# EAGLE design TactA (EAGLE 6.6.0)
An electronic circuit that enables experiments with capacitive sensing. For more details visit: https://github.com/StudioNAND/tact-hardware.
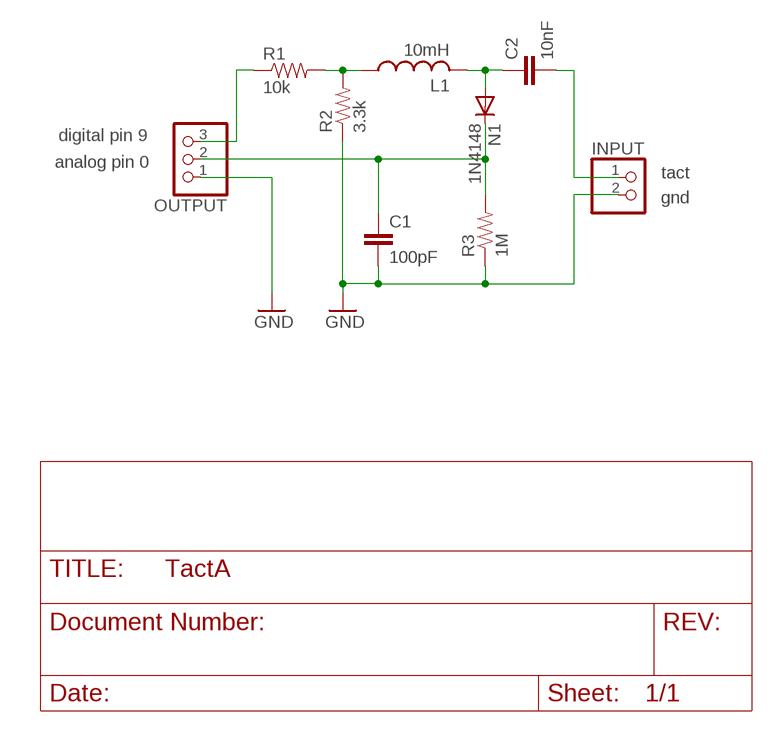
[diagram p0: schematic, sheet 1]

## Parts
C1  100pF  CAPPTH  [CAP-PTH-SMALL]
C2  10nF  CAPPTH  [CAP-PTH-SMALL]
INPUT  PINHD-1X2  [1X02]
L1  10mH  L-US6000-XXX-RC  [6000-XXXX-RC]
N1  1N4148  1N4148DO35-7  [DO35-7]
OUTPUT  PINHD-1X3  [1X03]
R1  10k  RESISTORPTH-1/4W  [AXIAL-0.4]
R2  3.3k  RESISTORPTH-1/4W  [AXIAL-0.4]
R3  1M  RESISTORPTH-1/4W  [AXIAL-0.4]

## Nets
A0: C1.1 N1.C OUTPUT.2 R3.P$2
D9: OUTPUT.3 R1.P$1
GND: C1.2 INPUT.2 OUTPUT.1 R2.P$1 R3.P$1
N$92: L1.1 R1.P$2 R2.P$2
N$144: C2.1 L1.2 N1.A
TACTSENSE: C2.2 INPUT.1

## Notes on the sheet
- digital pin 9
- analog pin 0
- tact
- gnd

## Library data of the parts
C1 C2 = SparkFun-Passives:CAP: Capacitor Standard 0603 ceramic capacitor, and 0.1" leaded capacitor.
INPUT = pinhead:PINHD-1X2: PIN HEADER
L1 = rcl:L-US: INDUCTOR, American symbol
N1 = diode:1N4148: DIODE high speed (Philips)
OUTPUT = pinhead:PINHD-1X3: PIN HEADER
R1-R3 = SparkFun-Passives:RESISTOR: Resistor Basic schematic elements and footprints for 0603, 1206, and PTH resistors.

## Board
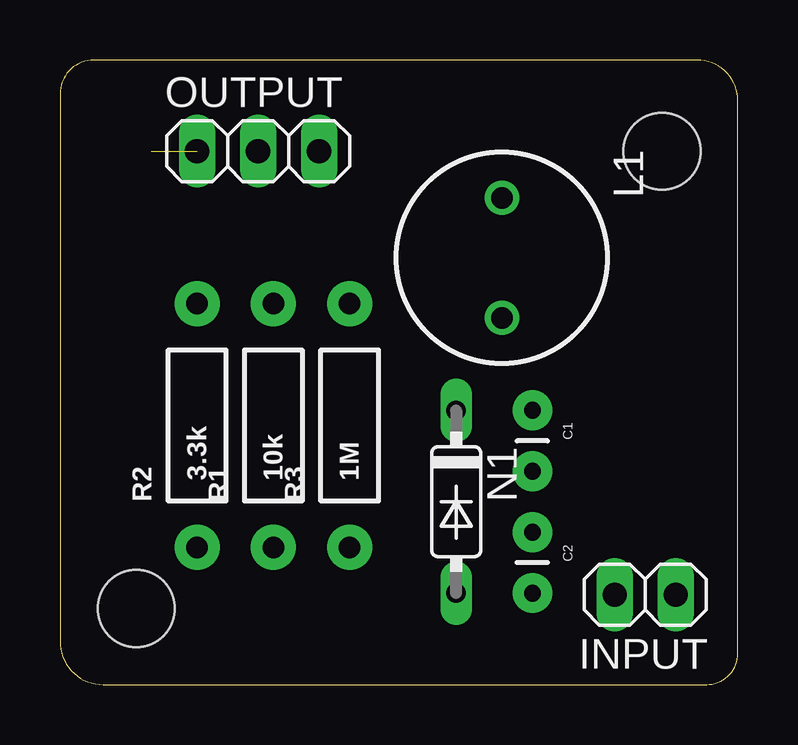
[diagram p1: board, top side]
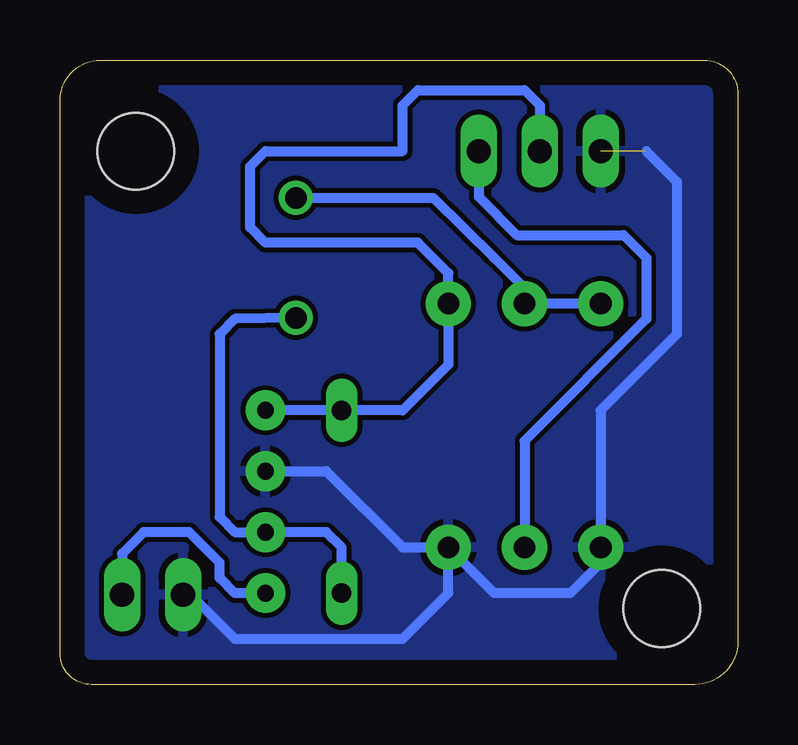
[diagram p2: board, bottom side, seen from below]

Size 28.25 x 26.02 mm. Coordinates in mm from the lower left corner, seen from the top.
Outline: 0,24.61 0,1.8 arc90 1.8,0 26.94,0 arc90 28.25,1.31 28.25,24.33 arc90 26.55,26.02 1.42,26.02 arc90 0,24.61
Copper layers (1*16): Top 0.035mm / dielectric 1.5mm / Bottom 0.035mm
Design rules "default *": minimum track width 10mil, minimum drill 24mil, track to track 8mil, track to pad 8mil, pad to pad 8mil, via to via 8mil, smd to smd 8mil, copper to edge 40mil, drill to drill 8mil, minimum pad ring 10mil, minimum via ring 8mil, stop-mask expansion 4mil, vias tented up to drill 0mil, thermal gap 10mil
Holes 3.2 mm at 3.17,3.17 25.08,22.23

### Footprints (pad centres in the part's own frame; a part is rotated, then mirrored left to right if it is on the bottom)
CAP-PTH-SMALL = drill 0.7 pad 1.651: 1 0,0; 2 2.54,0
1X02 = drill 1.016 long: 1 -1.27,0; 2 1.27,0
6000-XXXX-RC = drill 0.9 pad 1.422: 1 -2.5,0; 2 2.5,0
DO35-7 = drill 0.813 long: A 3.81,0; C -3.81,0
1X03 = drill 1.016 long: 1 -2.54,0; 2 0,0; 3 2.54,0
AXIAL-0.4 = drill 0.9 pad 1.88: P$1 -5.08,0; P$2 5.08,0

### Placement (x,y rotation side)
C1  19.68,11.43 270 top
C2  19.68,6.35 270 top
INPUT  24.38,3.75 180 top
L1  18.41,17.78 270 top
N1  16.51,7.62 270 top
OUTPUT  8.26,22.23 0 top
R1  8.89,10.79 90 top
R2  5.71,10.79 90 top
R3  12.06,10.79 90 top

### Tracks (layer width: path | path; a pad name or v marks a point on that pad's centre or on a via)
A0
  Bottom 0.406: C1.1 N1.C 13.97,11.43 12.06,13.34 R3.P$2 12.06,17.14 13.34,18.41 19.68,18.41 20.32,19.05 20.32,21.59 19.68,22.23 13.97,22.23 13.97,24.13 13.34,24.77 8.89,24.77 8.26,24.13 OUTPUT.2
D9
  Bottom 0.406: OUTPUT.3 10.79,20.32 9.21,18.73 4.76,18.73 3.81,17.78 3.81,15.24 8.89,10.16 R1.P$1
GND  (1 unrouted)
  Bottom 0.406: C1.2 17.14,8.89 13.97,5.71 R3.P$1 | R3.P$1 10.16,3.81 6.99,3.81 5.71,5.08 R2.P$1 5.71,11.43 2.54,14.61 2.54,20.95 3.81,22.23 | INPUT.2 22.8,3.75 20.95,1.91 13.97,1.91 12.06,3.81 R3.P$1
  pour Bottom: 0,0 0,25.4 27.94,25.4 27.94,0
N$92
  Bottom 0.406: L1.1 12.7,20.28 10.16,17.78 8.89,16.51 R1.P$2 R2.P$2
N$144
  Bottom 0.406: N1.A 16.51,5.71 17.14,6.35 C2.1 20.95,6.35 21.59,6.99 21.59,14.61 20.95,15.24 L1.2
TACTSENSE
  Bottom 0.406: C2.2 20.95,3.81 21.59,4.45 21.59,5.08 22.86,6.35 24.77,6.35 25.65,5.46 INPUT.1

### Text on the board
Print: A0 | D9 | GND | creative / coding.org | 100pF | 3.3k | 10k | 1M | TACT A | GND | SENSE | 1N4148 | 10nF